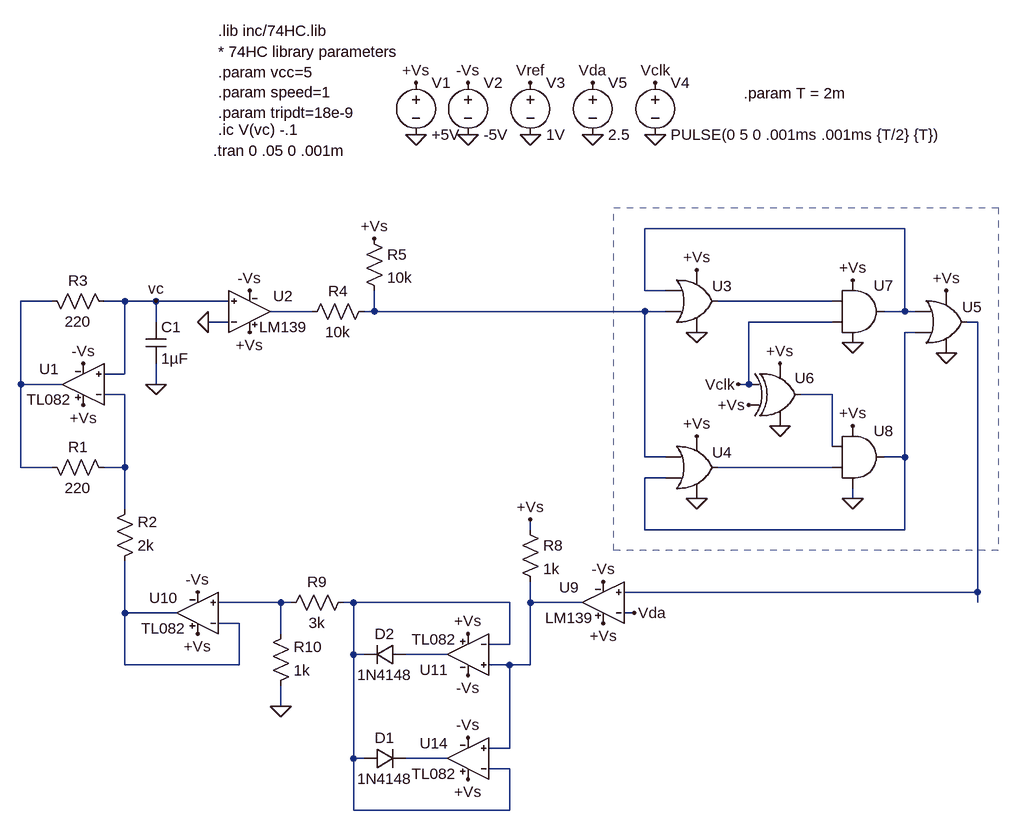
[diagram p0: schematic tentMapCircuitRev3.asc]
tentMapCircuitRev3.asc, the LTspice schematic file:
Version 4
SHEET 1 1284 680
WIRE 768 -368 368 -368
WIRE 368 -272 368 -368
WIRE 400 -272 368 -272
WIRE -544 -256 -592 -256
WIRE -432 -256 -464 -256
WIRE -384 -256 -432 -256
WIRE -272 -256 -384 -256
WIRE 656 -256 480 -256
WIRE -144 -240 -208 -240
WIRE -48 -240 -48 -272
WIRE -48 -240 -64 -240
WIRE 368 -240 -48 -240
WIRE 400 -240 368 -240
WIRE 768 -240 768 -368
WIRE 768 -240 736 -240
WIRE 784 -240 768 -240
WIRE -384 -224 -384 -256
WIRE -272 -224 -304 -224
WIRE 656 -224 528 -224
WIRE 880 -224 864 -224
WIRE 784 -208 768 -208
WIRE -432 -144 -432 -256
WIRE -432 -144 -464 -144
WIRE -592 -128 -592 -256
WIRE -528 -128 -592 -128
WIRE -384 -128 -384 -160
WIRE 528 -128 528 -224
WIRE 528 -128 512 -128
WIRE -432 -112 -464 -112
WIRE 656 -112 608 -112
WIRE 656 -32 656 -112
WIRE 368 -16 368 -240
WIRE 400 -16 368 -16
WIRE 768 -16 768 -208
WIRE 768 -16 736 -16
WIRE -592 0 -592 -128
WIRE -544 0 -592 0
WIRE -432 0 -432 -112
WIRE -432 0 -464 0
WIRE 656 0 480 0
WIRE 400 16 368 16
WIRE 688 48 688 32
WIRE -432 64 -432 0
WIRE 192 96 192 80
WIRE 368 96 368 16
WIRE 768 96 768 -16
WIRE 768 96 368 96
WIRE 880 192 880 -224
WIRE 880 192 336 192
WIRE -192 208 -288 208
WIRE -176 208 -192 208
WIRE -80 208 -96 208
WIRE 160 208 -80 208
WIRE 192 208 192 176
WIRE 272 208 192 208
WIRE 880 208 880 192
WIRE -432 224 -432 144
WIRE -352 224 -432 224
WIRE 352 224 336 224
WIRE -256 240 -288 240
WIRE -192 256 -192 208
WIRE 160 272 160 208
WIRE 160 272 128 272
WIRE -80 288 -80 208
WIRE -64 288 -80 288
WIRE 64 288 0 288
WIRE -432 304 -432 224
WIRE -256 304 -256 240
WIRE -256 304 -432 304
WIRE 160 304 128 304
WIRE 192 304 192 208
WIRE 192 304 160 304
WIRE -192 368 -192 336
WIRE 160 432 160 304
WIRE 160 432 128 432
WIRE -80 448 -80 288
WIRE -64 448 -80 448
WIRE 64 448 0 448
WIRE 160 464 128 464
WIRE -80 528 -80 448
WIRE 160 528 160 464
WIRE 160 528 -80 528
FLAG 96 -512 0
FLAG 16 -512 0
FLAG 96 -592 -Vs
FLAG -496 -160 -Vs
FLAG 16 -592 +Vs
FLAG -496 -96 +Vs
FLAG -384 -128 0
FLAG -384 -256 vc
FLAG -240 -272 -Vs
FLAG -240 -208 +Vs
FLAG 192 -512 0
FLAG 192 -592 Vref
FLAG -48 -352 +Vs
FLAG 448 -208 0
FLAG 448 -304 +Vs
FLAG 448 48 0
FLAG 448 -48 +Vs
FLAG 832 -176 0
FLAG 832 -272 +Vs
FLAG 576 -64 0
FLAG 528 -96 +Vs
FLAG 688 -192 0
FLAG 688 -288 +Vs
FLAG 688 48 0
FLAG 688 -64 +Vs
FLAG 576 -160 +Vs
FLAG 384 -512 0
FLAG 384 -592 Vclk
FLAG 512 -128 Vclk
FLAG 304 176 -Vs
FLAG 304 240 +Vs
FLAG 352 224 Vda
FLAG 288 -512 0
FLAG 288 -592 Vda
FLAG -320 192 -Vs
FLAG -320 256 +Vs
FLAG 192 80 +Vs
FLAG -304 -224 0
FLAG 96 320 -Vs
FLAG 96 256 +Vs
FLAG 96 416 -Vs
FLAG 96 480 +Vs
FLAG -192 368 0
SYMBOL TL082 -496 -128 M0
SYMATTR InstName U1
SYMBOL voltage 16 -608 R0
SYMATTR InstName V1
SYMATTR Value +5V
SYMBOL voltage 96 -608 R0
SYMATTR InstName V2
SYMATTR Value -5V
SYMBOL res -560 -16 M90
WINDOW 0 0 56 VBottom 2
WINDOW 3 32 56 VTop 2
SYMATTR InstName R1
SYMATTR Value 220
SYMBOL res -448 160 M180
WINDOW 0 36 76 Left 2
WINDOW 3 36 40 Left 2
SYMATTR InstName R2
SYMATTR Value 2k
SYMBOL res -560 -272 M90
WINDOW 0 0 56 VBottom 2
WINDOW 3 32 56 VTop 2
SYMATTR InstName R3
SYMATTR Value 220
SYMBOL cap -400 -224 R0
SYMATTR InstName C1
SYMATTR Value 1µF
SYMBOL LM139 -240 -240 R0
SYMATTR InstName U2
SYMBOL voltage 192 -608 R0
SYMATTR InstName V3
SYMATTR Value 1V
SYMBOL res -48 -256 R90
WINDOW 0 0 56 VBottom 2
WINDOW 3 32 56 VTop 2
SYMATTR InstName R4
SYMATTR Value 10k
SYMBOL res -64 -368 R0
SYMATTR InstName R5
SYMATTR Value 10k
SYMBOL 74HC32 448 -320 R0
WINDOW 0 24 41 Left 2
SYMATTR InstName U3
SYMBOL 74HC32 448 -64 R0
WINDOW 0 24 41 Left 2
SYMATTR InstName U4
SYMBOL 74HC32 832 -288 R0
WINDOW 0 24 41 Left 2
SYMATTR InstName U5
SYMBOL 74HC86 576 -176 R0
WINDOW 0 23 38 Left 2
SYMATTR InstName U6
SYMBOL 74HC08 704 -304 R0
SYMATTR InstName U7
SYMBOL 74HC08 704 -80 R0
SYMATTR InstName U8
SYMBOL voltage 384 -608 R0
WINDOW 123 0 0 Left 0
WINDOW 39 0 0 Left 0
SYMATTR InstName V4
SYMATTR Value PULSE(0 5 0 .001ms .001ms {T/2} {T})
SYMBOL LM139 304 208 M0
SYMATTR InstName U9
SYMBOL voltage 288 -608 R0
SYMATTR InstName V5
SYMATTR Value 2.5
SYMBOL diode -64 464 R270
WINDOW 0 32 32 VTop 2
WINDOW 3 0 32 VBottom 2
SYMATTR InstName D1
SYMATTR Value 1N4148
SYMBOL diode 0 304 M270
WINDOW 0 32 32 VTop 2
WINDOW 3 0 32 VBottom 2
SYMATTR InstName D2
SYMATTR Value 1N4148
SYMBOL TL082 -320 224 M0
SYMATTR InstName U10
SYMBOL res 176 80 R0
SYMATTR InstName R8
SYMATTR Value 1k
SYMBOL TL082 96 288 R180
SYMATTR InstName U11
SYMBOL TL082 96 448 M0
SYMATTR InstName U14
SYMBOL res -80 192 R90
WINDOW 0 0 56 VBottom 2
WINDOW 3 32 56 VTop 2
SYMATTR InstName R9
SYMATTR Value 3k
SYMBOL res -208 352 M180
WINDOW 0 36 76 Left 2
WINDOW 3 36 40 Left 2
SYMATTR InstName R10
SYMATTR Value 1k
TEXT -288 -520 Left 2 !.ic V(vc) -.1
TEXT -296 -488 Left 2 !.tran 0 .05 0 .001m
TEXT -288 -672 Left 2 !.lib inc/74HC.lib
TEXT -288 -640 Left 2 !* 74HC library parameters\n.param vcc=5\n.param speed=1\n.param tripdt=18e-9
TEXT 520 -576 Left 2 !.param T = 2m
RECTANGLE Normal 912 128 320 -400 2

The netlist it stands for:
* tentMapCircuitRev3.asc
XU1 vc N008 +Vs -Vs N002 TL082  ; pins 1 2 3 4 5
V1 +Vs 0 +5V
V2 -Vs 0 -5V
R1 N002 N008 220
R2 N014 N008 2k
R3 N002 vc 220
C1 vc 0 1µF
XU2 vc 0 +Vs -Vs N004 LM139  ; pins 1 2 3 4 5
V3 Vref 0 1V
R4 N005 N004 10k
R5 +Vs N005 10k
XU3 N001 N005 N003 +Vs 0 74HC32  ; pins A B Y VCC VGND
XU4 N005 N007 N010 +Vs 0 74HC32  ; pins A B Y VCC VGND
XU5 N001 N007 N006 +Vs 0 74HC32  ; pins A B Y VCC VGND
XU6 Vclk +Vs N009 +Vs 0 74HC86  ; pins A B Y VCC VGND
XU7 N003 Vclk N001 +Vs 0 74HC08  ; pins A B Y VCC VGND
XU8 N009 N010 N007 +Vs 0 74HC08  ; pins A B Y VCC VGND
V4 Vclk 0 PULSE(0 5 0 .001ms .001ms {T/2} {T})
XU9 N006 Vda +Vs -Vs N013 LM139  ; pins 1 2 3 4 5
V5 Vda 0 2.5
D1 N012 N016 1N4148
D2 N015 N012 1N4148
XU10 N011 N014 +Vs -Vs N014 TL082  ; pins 1 2 3 4 5
R8 +Vs N013 1k
XU11 N013 N012 +Vs -Vs N015 TL082  ; pins 1 2 3 4 5
XU14 N013 N012 +Vs -Vs N016 TL082  ; pins 1 2 3 4 5
R9 N012 N011 3k
R10 0 N011 1k
.model D D
.lib standard.dio
.ic V(vc) -.1
.tran 0 .05 0 .001m
.lib inc/74HC.lib
* 74HC library parameters
.param vcc=5
.param speed=1
.param tripdt=18e-9
.param T = 2m
.lib inc/TL082.sp
.lib inc\LM139.sp
.backanno
.end